# EAGLE design E4-blackpill-v2 (EAGLE 9.6.2)
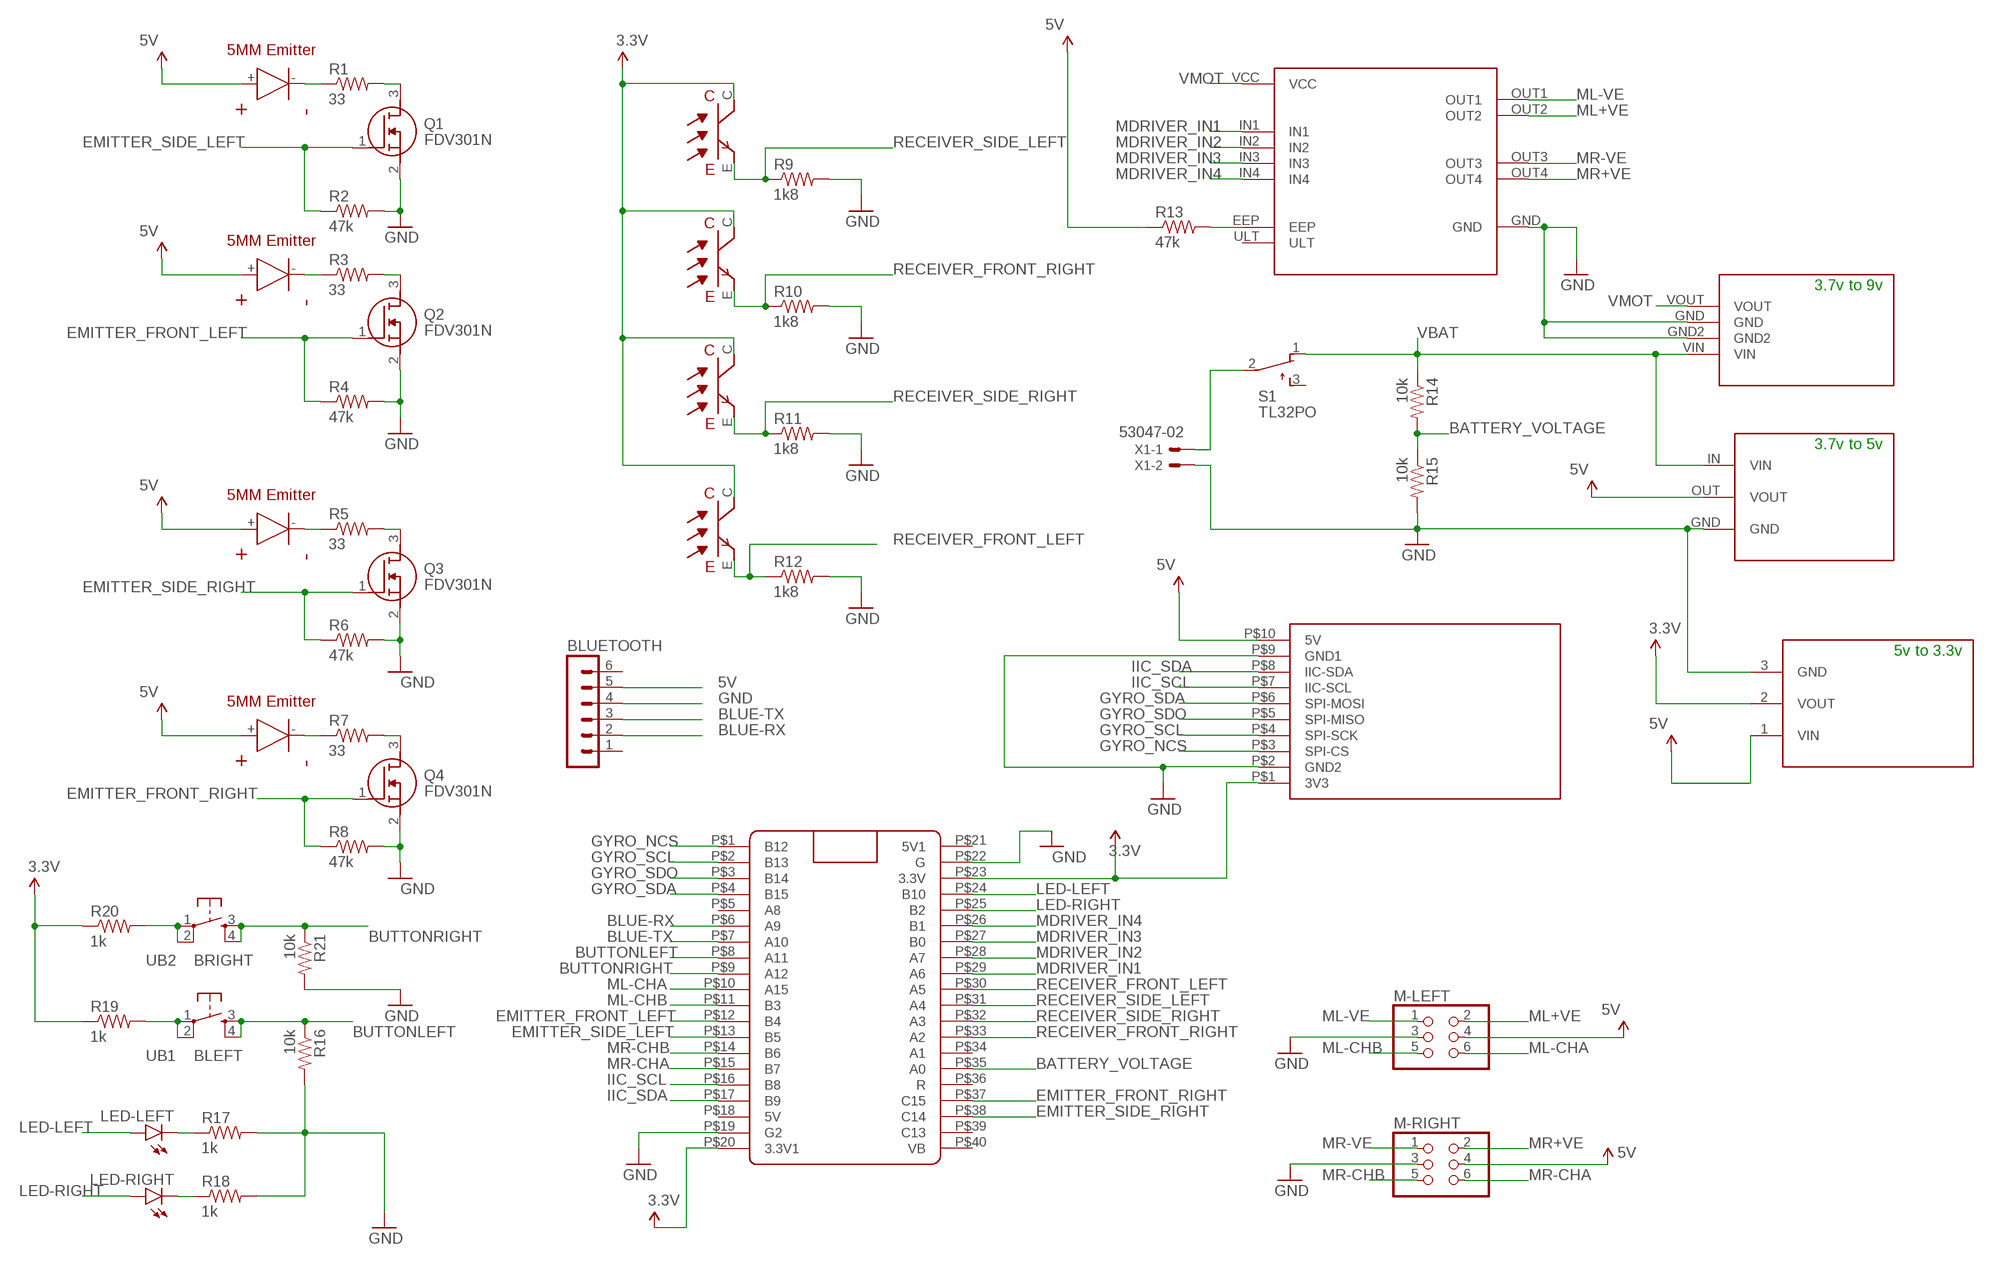
[diagram p0: schematic, sheet 1]

## Parts
BLUETOOTH  MA06-1  [MA06-1]
DET-FRONTLEFT  RECEIVER  [RECEIVER]
DET-FRONTRIGHT  RECEIVER  [RECEIVER]
DET-SIDELEFT  RECEIVER  [RECEIVER]
DET-SIDERIGHT  RECEIVER  [RECEIVER]
IR-FRONTLEFT  EMITTER  [EMITTER]
IR-FRONTRIGHT  EMITTER  [EMITTER]
IR-SIDELEFT  EMITTER  [EMITTER]
IR-SIDERIGHT  EMITTER  [EMITTER]
LED-LEFT  LEDSML0603  [SML0603]
LED-RIGHT  LEDSML0603  [SML0603]
M-LEFT  PINHD-2X3  [2X03]
M-RIGHT  PINHD-2X3  [2X03]
Q1  FDV301N  [SOT96P237X111-3N]
Q2  FDV301N  [SOT96P237X111-3N]
Q3  FDV301N  [SOT96P237X111-3N]
Q4  FDV301N  [SOT96P237X111-3N]
R1  33  RESISTOR1206  [1206]
R2  47k  RESISTOR0603-RES  [0603-RES]
R3  33  RESISTOR1206  [1206]
R4  47k  RESISTOR0603-RES  [0603-RES]
R5  33  RESISTOR1206  [1206]
R6  47k  RESISTOR0603-RES  [0603-RES]
R7  33  RESISTOR1206  [1206]
R8  47k  RESISTOR0603-RES  [0603-RES]
R9  1k8  RESISTOR0603-RES  [0603-RES]
R10  1k8  RESISTOR0603-RES  [0603-RES]
R11  1k8  RESISTOR0603-RES  [0603-RES]
R12  1k8  RESISTOR0603-RES  [0603-RES]
R13  47k  RESISTOR0603-RES  [0603-RES]
R14  10k  RESISTOR0603-RES  [0603-RES]
R15  10k  RESISTOR0603-RES  [0603-RES]
R16  10k  RESISTOR0603-RES  [0603-RES]
R17  1k  RESISTOR0603-RES  [0603-RES]
R18  1k  RESISTOR0603-RES  [0603-RES]
R19  1k  RESISTOR0603-RES  [0603-RES]
R20  1k  RESISTOR0603-RES  [0603-RES]
R21  10k  RESISTOR0603-RES  [0603-RES]
S1  TL32PO  [TL3XPO]
U$1  E4_SPI-IIC  [E4_SPI-IIC]
U$3  DRV8833  [DRV8833]
U$4  BUCK3TO9BUCK3TO9-HORIZONTAL  [BUCK3TO9-HORIZONTAL]
U$5  BUCK3TO5  [BUCK3TO5-H]
U$7  BLACK_PILL  [BLACK_PILL]
U$8  3V3-CONV3V3CONV  [6410-03]
UB1  BLEFT  TAC_SWITCHPTH  [TACTILE-PTH]
UB2  BRIGHT  TAC_SWITCHPTH  [TACTILE-PTH]
X1  53047-02  [53047-02]

## Nets
3.3V: DET-FRONTLEFT.C DET-FRONTRIGHT.C DET-SIDELEFT.C DET-SIDERIGHT.C R19.1 R20.1 U$1.P$1(3V3) U$7.P$20(3.3V1) U$7.P$23(3.3V) U$8.2(VOUT)
5V: BLUETOOTH.5 IR-FRONTLEFT.+ IR-FRONTRIGHT.+ IR-SIDELEFT.+ IR-SIDERIGHT.+ M-LEFT.4 M-RIGHT.4 R13.1 U$1.P$10(5V) U$5.OUT(VOUT) U$8.1(VIN)
BATTERY_VOLTAGE: R14.2 R15.1 U$7.P$35(A0)
BLUE-RX: BLUETOOTH.2 U$7.P$6(A9)
BLUE-TX: BLUETOOTH.3 U$7.P$7(A10)
BUTTONLEFT: R16.1 U$7.P$8(A11) UB1.3 UB1.4
BUTTONRIGHT: R21.1 U$7.P$9(A12) UB2.3 UB2.4
EMITTER_FRONT_LEFT: Q2.1(G) R4.1 U$7.P$12(B4)
EMITTER_FRONT_RIGHT: Q4.1(G) R8.1 U$7.P$37(C15)
EMITTER_SIDE_LEFT: Q1.1(G) R2.1 U$7.P$13(B5)
EMITTER_SIDE_RIGHT: Q3.1(G) R6.1 U$7.P$38(C14)
GND: BLUETOOTH.4 M-LEFT.3 M-RIGHT.3 Q1.2(S) Q2.2(S) Q3.2(S) Q4.2(S) R2.2 R4.2 R6.2 R8.2 R9.2 R10.2 R11.2 R12.2 R15.2 R16.2 R17.2 R18.2 R21.2 U$1.P$2(GND2) U$1.P$9(GND1) U$3.GND U$4.GND U$4.GND2 U$5.GND U$7.P$19(G2) U$7.P$22(G) U$8.3(GND) X1.2
GYRO_NCS: U$1.P$3(SPI-CS) U$7.P$1(B12)
GYRO_SCL: U$1.P$4(SPI-SCK) U$7.P$2(B13)
GYRO_SDA: U$1.P$6(SPI-MOSI) U$7.P$4(B15)
GYRO_SDO: U$1.P$5(SPI-MISO) U$7.P$3(B14)
IIC_SCL: U$1.P$7(IIC-SCL) U$7.P$16(B8)
IIC_SDA: U$1.P$8(IIC-SDA) U$7.P$17(B9)
LED-LEFT: LED-LEFT.A U$7.P$24(B10)
LED-RIGHT: LED-RIGHT.A U$7.P$25(B2)
MDRIVER_IN1: U$3.IN1 U$7.P$29(A6)
MDRIVER_IN2: U$3.IN2 U$7.P$28(A7)
MDRIVER_IN3: U$3.IN3 U$7.P$27(B0)
MDRIVER_IN4: U$3.IN4 U$7.P$26(B1)
ML+VE: M-LEFT.2 U$3.OUT2
ML-CHA: M-LEFT.6 U$7.P$10(A15)
ML-CHB: M-LEFT.5 U$7.P$11(B3)
ML-VE: M-LEFT.1 U$3.OUT1
MR+VE: M-RIGHT.2 U$3.OUT4
MR-CHA: M-RIGHT.6 U$7.P$15(B7)
MR-CHB: M-RIGHT.5 U$7.P$14(B6)
MR-VE: M-RIGHT.1 U$3.OUT3
N$1: IR-FRONTRIGHT.- R7.1
N$2: Q1.3(D) R1.2
N$3: IR-SIDELEFT.- R1.1
N$4: IR-FRONTLEFT.- R3.1
N$5: Q2.3(D) R3.2
N$6: Q4.3(D) R7.2
N$7: IR-SIDERIGHT.- R5.1
N$8: Q3.3(D) R5.2
N$9: R13.2 U$3.EEP
N$10: LED-RIGHT.C R18.1
N$11: LED-LEFT.C R17.1
N$12: R19.2 UB1.1 UB1.2
N$13: R20.2 UB2.1 UB2.2
N$14: S1.2(P) X1.1
RECEIVER_FRONT_LEFT: DET-FRONTLEFT.E R12.1 U$7.P$30(A5)
RECEIVER_FRONT_RIGHT: DET-FRONTRIGHT.E R10.1 U$7.P$33(A2)
RECEIVER_SIDE_LEFT: DET-SIDELEFT.E R9.1 U$7.P$31(A4)
RECEIVER_SIDE_RIGHT: DET-SIDERIGHT.E R11.1 U$7.P$32(A3)
VBAT: R14.1 S1.1(O) U$4.VIN U$5.IN(VIN)
VMOT: U$3.VCC U$4.VOUT
Unconnected: BLUETOOTH.1 BLUETOOTH.6 S1.3(S) U$3.ULT U$7.P$5(A8) U$7.P$18(5V) U$7.P$34(A1) U$7.P$36(R) U$7.P$39(C13) U$7.P$40(VB)

## Notes on the sheet
- 3.7v to 9v
- 3.7v to 5v
- 5v to 3.3v

## Power pins joined to a net without a drawn wire
5V1: U$7.P$21(5V1)

## Library data of the parts
BLUETOOTH = con-lstb:MA06-1: PIN HEADER; OC_FARNELL: unknown; OC_NEWARK: unknown
DET-FRONTLEFT DET-FRONTRIGHT DET-SIDELEFT DET-SIDERIGHT = sfh4550 & teft4300:RECEIVER
IR-FRONTLEFT IR-FRONTRIGHT IR-SIDELEFT IR-SIDERIGHT = sfh4550 & teft4300:EMITTER
LED-LEFT LED-RIGHT = led:LED: LED OSRAM: - CHIPLED LG R971, LG N971, LY N971, LG Q971, LY Q971, LO R971, LY R971 LH N974, LH R974 LS Q976, LO Q976, LY Q976 LO Q996 - Hyper CHIPLED LW Q18S LB Q993, LB Q99A, LB R99A - SideLED LS A670, LO A670, LY A670, LG A670, LP A670 LB A673, LV A673, LT A673, LW A673 LH A674 LY A675 LS A676, LA A676, LO A676, LY A676, LW A676 LS A679, LY A679, LG A679 - Hyper Micro SIDELED® LS Y876, LA Y876, LO Y876, LY Y876 LT Y87S - SmartLED LW L88C, LW L88S LB L89C, LB L89S, LG L890 LS L89K, LO L89K, LY L89K LS L896, LA L896, LO L896, LY L896 - TOPLED LS T670, LO T670, LY T670, LG T670, LP T670 LSG T670, LSP T670, LSY T670, LOP T670, LYG T670 LG T671, LOG T671, LSG T671 LB T673, LV T673, LT T673, LW T673 LH T674 LS T676, LA T676, LO T676, LY T676, LB T676, LH T676, LSB T676, LW T676 LB T67C, LV T67C, LT T67C, LS T67K, LO T67K, LY T67K, LW E67C LS E67B, LA E67B, LO E67B, LY E67B, LB E67C, LV E67C, LT E67C LW T67C LS T679, LY T679, LG T679 LS T770, LO T770, LY T770, LG T770, LP T770 LB T773, LV T773, LT T773, LW T773 LH T774 LS E675, LA E675, LY E675, LS T675 LS T776, LA T776, LO T776, LY T776, LB T776 LHGB T686 LT T68C, LB T68C - Hyper Mini TOPLED® LB M676 - Mini TOPLED Santana® LG M470 LS M47K, LO M47K, LY M47K Source: http://www.osram.convergy.de LUXEON: - LUMILED® LXK2-PW12-R00, LXK2-PW12-S00, LXK2-PW14-U00, LXK2-PW14-V00 LXK2-PM12-R00, LXK2-PM12-S00, LXK2-PM14-U00 LXK2-PE12-Q00, LXK2-PE12-R00, LXK2-PE12-S00, LXK2-PE14-T00, LXK2-PE14-U00 LXK2-PB12-K00, LXK2-PB12-L00, LXK2-PB12-M00, LXK2-PB14-N00, LXK2-PB14-P00, LXK2-PB14-Q00 LXK2-PR12-L00, LXK2-PR12-M00, LXK2-PR14-Q00, LXK2-PR14-R00 LXK2-PD12-Q00, LXK2-PD12-R00, LXK2-PD12-S00 LXK2-PH12-R00, LXK2-PH12-S00 LXK2-PL12-P00, LXK2-PL12-Q00, LXK2-PL12-R00 Source: www.luxeon.com KINGBRIGHT: KA-3528ASYC Source: www.kingbright.com
M-LEFT M-RIGHT = SparkFun:PINHD-2X3: PIN HEADER
Q1-Q4 = FDV301N:FDV301N: MOSFET N-Channel 25V 0.5A SOT23 Fairchild FDV301N N-channel MOSFET Transistor, 0.22 A, 25 V, 3-Pin SOT-23 Source: Datasheet <https://datasheet.datasheetarchive.com/originals/distributors/Datasheets_SAMA/0cce9550595c1a9ba17b856c55fee955.pdf>; ARROW_PART_NUMBER: FDV301N; ARROW_PRICE-STOCK: https://www.arrow.com/en/products/fdv301n/on-semiconductor?region=nac; DESCRIPTION: MOSFET N-Channel 25V 0.5A SOT23 Fairchild FDV301N N-channel MOSFET Transistor, 0.22 A, 25 V, 3-Pin SOT-23; HEIGHT: 1.11mm; MANUFACTURER_NAME: onsemi; MANUFACTURER_PART_NUMBER: FDV301N; MOUSER_PART_NUMBER: 512-FDV301N; MOUSER_PRICE-STOCK: https://www.mouser.co.uk/ProductDetail/ON-Semiconductor-Fairchild/FDV301N?qs=HK%252BeIG1iaahv7gPT5tsFJQ%3D%3D
R1-R21 = SparkFun:RESISTOR: Resistor Basic schematic elements and footprints for 0603, 1206, and PTH resistors.
S1 = switch:TL32PO: TINY SWITCH ON - MOM Source: http://www2.produktinfo.conrad.com/datenblaetter/700000-724999/705152-da-01-de-Subminiaturschalter_TL_36YO.pdf
U$1 = E4:E4_SPI-IIC
U$3 = E4:DRV8833
U$4 = E4:BUCK3TO9
U$5 = E4:BUCK3TO5
U$7 = E4:BLACK_PILL
U$8 = E4:3V3-CONV
UB1 UB2 = SparkFun:TAC_SWITCH: Momentary Switch Button commonly used for reset or general input. Spark Fun Electronics SKU : COM-00097
X1 = con-molex:53?-02: CONNECTOR wire to board 1.25 mm (.049 inch) pitch header; MF: MOLEX; MPN: 53047-0210; OC_FARNELL: 9733051; OC_NEWARK: 57H4701

## Board
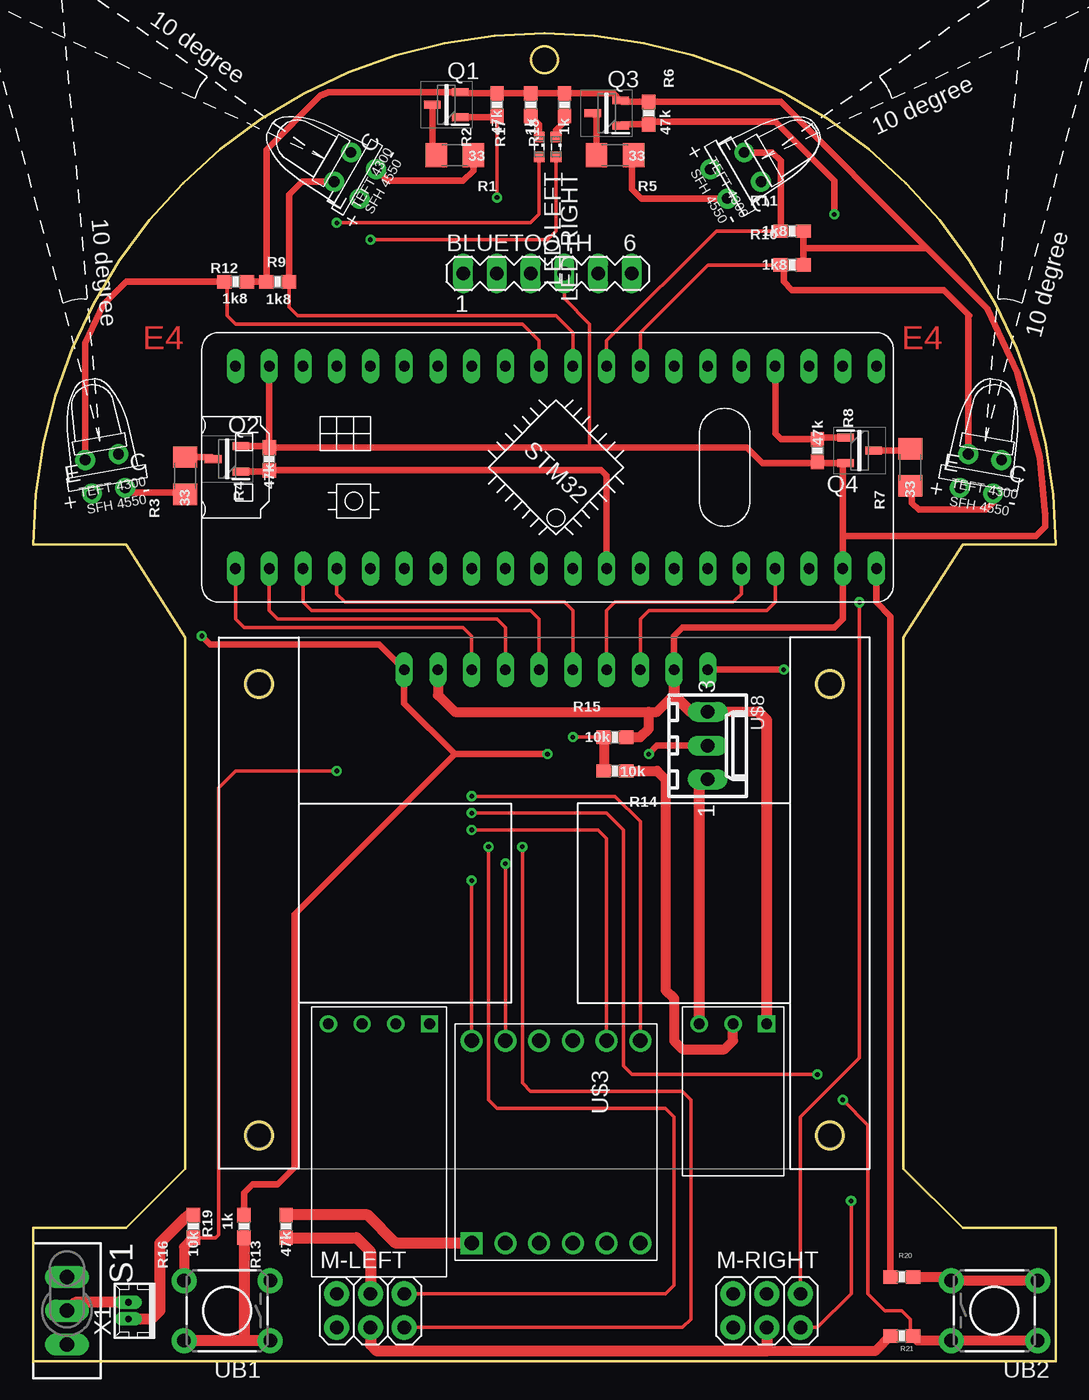
[diagram p1: board, top side]
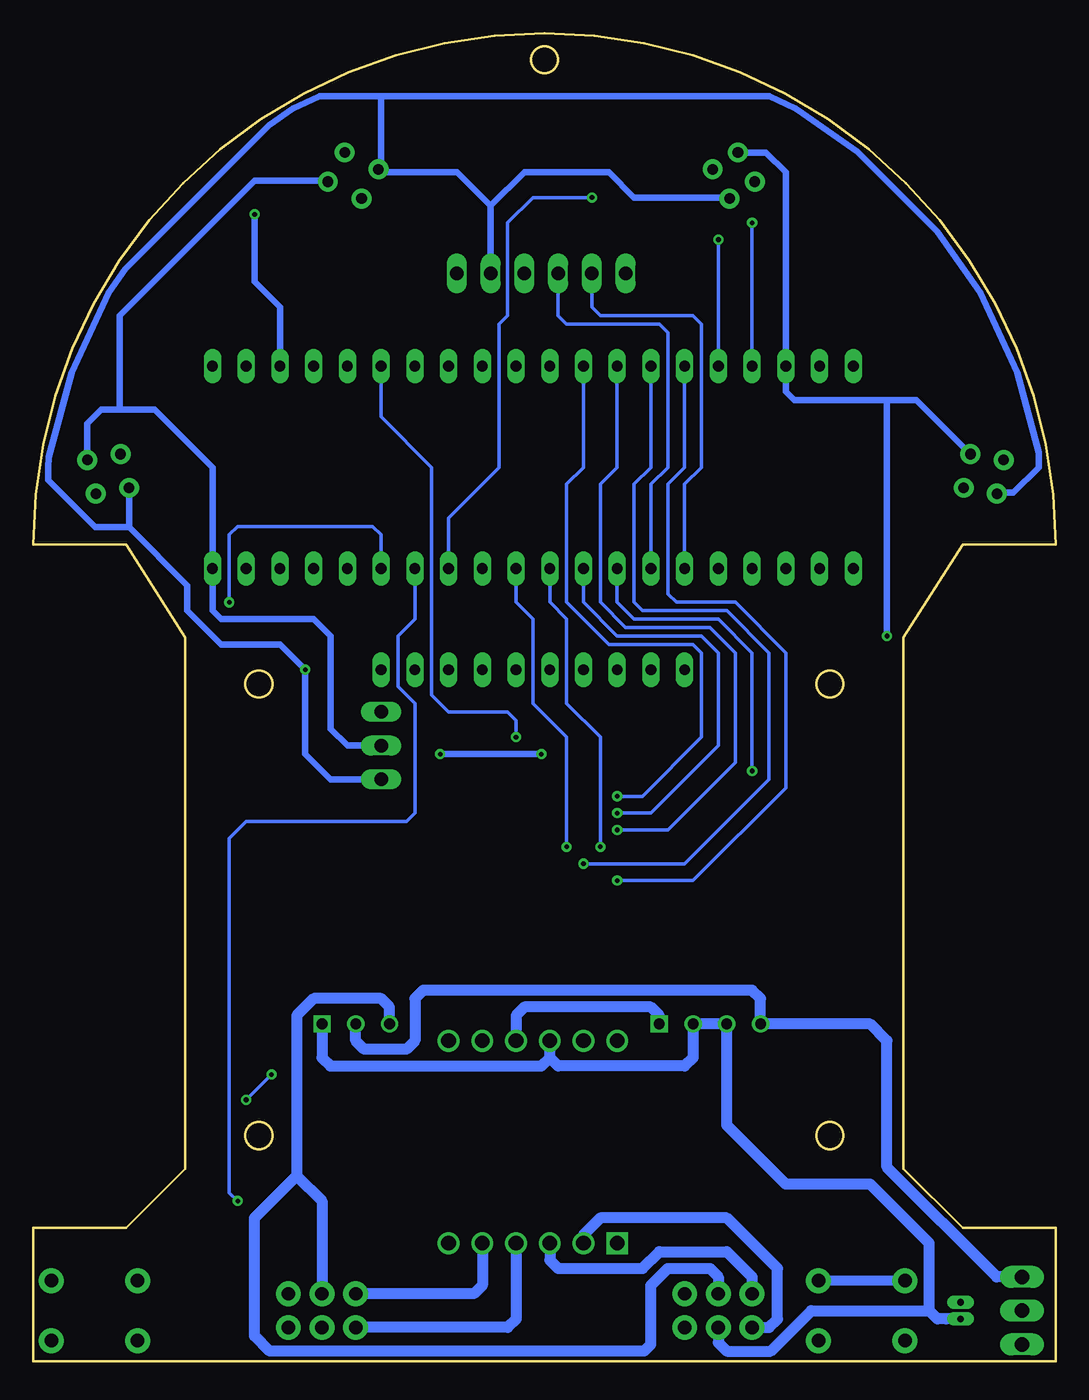
[diagram p2: board, bottom side, seen from below]

Size 77 x 100 mm. Coordinates in mm from the lower left corner, seen from the top.
Outline: 0,0 77,0 77,10.04 70,10.04 65.54,14.5 65.54,54.5 70,61.5 77,61.5 arc180 0,61.5 7,61.5 11.46,54.5 11.46,14.5 7,10.04 0,10.04 0,0
Outline: circle at 17,17 radius 1
Outline: circle at 60,17 radius 1
Outline: circle at 60,51 radius 1
Outline: circle at 17,51 radius 1
Outline: circle at 38.5,98 radius 1
Copper layers (1*16): Top 0.035mm / dielectric 1.5mm / Bottom 0.035mm
Design rules "default *": minimum track width 10mil, minimum drill 0.35mm, track to track 10mil, track to pad 10mil, pad to pad 10mil, via to via 10mil, smd to smd 10mil, copper to edge 10mil, drill to drill 6mil, minimum pad ring 10mil, minimum via ring 8mil, stop-mask expansion 4mil, vias tented up to drill 0mil, thermal gap 10mil

### Footprints (pad centres in the part's own frame; a part is rotated, then mirrored left to right if it is on the bottom)
MA06-1 = drill 1.016 long: 1 -6.35,0; 2 -3.81,0; 3 -1.27,0; 4 1.27,0; 5 3.81,0; 6 6.35,0
RECEIVER = drill 0.8 pad 1.5: C 1.27,-0.5; E -1.27,-0.5
EMITTER = drill 0.8 pad 1.5: + -1.27,-0.5; - 1.27,-0.5
SML0603 = smd 0.8 x 0.8: A 0.75,0; C -0.75,0
2X03 = drill 1.016 pad 1.88: 1 -2.54,-1.27; 2 -2.54,1.27; 3 0,-1.27; 4 0,1.27; 5 2.54,-1.27; 6 2.54,1.27
SOT96P237X111-3N = smd 1.25 x 0.6: 1 -1.05,0.955; 2 -1.05,-0.955; 3 1.05,0
1206 = smd 1.6 x 1.8: 1 -1.4,0; 2 1.4,0
0603-RES = smd 1.1 x 1: 1 -0.85,0; 2 0.85,0
TL3XPO = drill 1.1 pad 1.422 long: 1 -2.54,0; 2 0,0; 3 2.54,0
E4_SPI-IIC = drill 0.8 long: P$1 -10.16,34.29; P$2 -7.62,34.29; P$3 -5.08,34.29; P$4 -2.54,34.29; P$5 0,34.29; P$6 2.54,34.29; P$7 5.08,34.29; P$8 7.62,34.29; P$9 10.16,34.29; P$10 12.7,34.29 | hole 2: -21.1,33.22; -21.1,-0.78; 21.9,33.22; 21.9,-0.78
DRV8833 = drill 1.1 square: EEP -7.62,5.08 | drill 1.1: GND 7.62,0; IN1 7.62,-7.62; IN2 7.62,-5.08; IN3 7.62,2.54; IN4 7.62,5.08; OUT1 -7.62,2.54; OUT2 -7.62,0; OUT3 -7.62,-2.54; OUT4 -7.62,-5.08; ULT -7.62,-7.62; VCC 7.62,-2.54
BUCK3TO9-HORIZONTAL = drill 0.8: GND -8.89,-5.08; GND2 -6.35,-5.08; VIN -3.81,-5.08 | drill 0.8 square: VOUT -11.43,-5.08
BUCK3TO5-H = drill 0.8 square: GND -8.89,0 | drill 0.8: IN -6.35,0; OUT -3.81,0
BLACK_PILL = drill 0.8 long: P$1 -7.62,15.24; P$2 -7.62,12.7; P$3 -7.62,10.16; P$4 -7.62,7.62; P$5 -7.62,5.08; P$6 -7.62,2.54; P$7 -7.62,0; P$8 -7.62,-2.54; P$9 -7.62,-5.08; P$10 -7.62,-7.62; P$11 -7.62,-10.16; P$12 -7.62,-12.7; P$13 -7.62,-15.24; P$14 -7.62,-17.78; P$15 -7.62,-20.32; P$16 -7.62,-22.86; P$17 -7.62,-25.4; P$18 -7.62,-27.94; P$19 -7.62,-30.48; P$20 -7.62,-33.02; P$21 7.62,15.24; P$22 7.62,12.7; P$23 7.62,10.16; P$24 7.62,7.62; P$25 7.62,5.08; P$26 7.62,2.54; P$27 7.62,0; P$28 7.62,-2.54; P$29 7.62,-5.08; P$30 7.62,-7.62; P$31 7.62,-10.16; P$32 7.62,-12.7; P$33 7.62,-15.24; P$34 7.62,-17.78; P$35 7.62,-20.32; P$36 7.62,-22.86; P$37 7.62,-25.4; P$38 7.62,-27.94; P$39 7.62,-30.48; P$40 7.62,-33.02
6410-03 = drill 1.016 long: 1 2.54,0; 2 0,0; 3 -2.54,0
TACTILE-PTH = drill 1.016 pad 1.88: 1 -3.251,2.261; 2 3.251,2.261; 3 -3.251,-2.261; 4 3.251,-2.261
53047-02 = drill 0.5 pad 0.698 long: 1 0.625,0.45; 2 -0.625,0.45

### Placement (x,y rotation side)
BLUETOOTH  38.73,81.92 0 top
DET-FRONTLEFT  5.08,68.58 10 top
DET-FRONTRIGHT  71.75,68.58 350 top
DET-SIDELEFT  22.86,90.17 60 top
DET-SIDERIGHT  54.61,90.17 300 top
IR-FRONTLEFT  5.59,66.04 10 top
IR-FRONTRIGHT  71.12,66.04 350 top
IR-SIDELEFT  24.77,88.9 60 top
IR-SIDERIGHT  52.07,88.9 300 top
LED-LEFT  38.1,91.44 270 top
LED-RIGHT  39.37,91.44 270 top
M-LEFT  25.4,3.81 0 top
M-RIGHT  55.24,3.81 0 top
Q1  31.11,94.61 180 top
Q2  14.61,67.94 180 top
Q3  43.18,93.98 180 top
Q4  62.23,68.58 0 top
R1  31.75,90.81 180 top
R2  34.92,94.61 90 top
R3  11.43,66.67 90 top
R4  17.78,67.94 90 top
R5  43.81,90.81 180 top
R6  46.35,93.98 90 top
R7  66.04,67.31 90 top
R8  59.05,68.58 270 top
R9  18.41,81.28 180 top
R10  57.15,82.55 0 top
R11  57.15,85.09 0 top
R12  15.24,81.28 0 top
R13  19.05,10.16 90 top
R14  43.81,44.45 180 top
R15  43.81,46.99 0 top
R16  12.06,10.16 90 top
R17  37.47,94.61 90 top
R18  40.01,94.61 90 top
R19  15.88,10.16 270 top
R20  65.41,6.35 0 top
R21  65.41,1.91 180 top
S1  2.54,3.81 270 top
U$1  38.1,17.78 0 top
U$3  38.1,16.51 90 top
U$4  18.41,20.32 180 top
U$5  46.35,25.4 180 top
U$7  30.48,67.31 90 top
U$8  50.8,46.35 270 top
UB1  14.61,3.81 180 top
UB2  72.39,3.81 0 top
X1  7.62,3.81 90 top

### Tracks (layer width: path | path; a pad name or v marks a point on that pad's centre or on a via)
3.3V  (via drill 0.35)
  Top 0.508: R19.1 15.88,12.7 16.51,13.34 18.41,13.34 19.68,14.61 19.68,33.66 31.75,45.72 | R20.1 64.56,56.09 63.5,57.15 U$7.P$20 | U$8.2 46.99,46.35 v46.35,45.72 | v38.73,45.72 31.75,45.72 | 31.75,45.72 27.94,49.53 U$1.P$1 26.04,53.98 13.34,53.98 v12.7,54.61
  Bottom 0.508: U$8.2 53.34,46.35 54.61,47.62 54.61,54.61 55.88,55.88 62.87,55.88 63.5,56.52 U$7.P$20 63.5,67.31 67.84,71.65 70.48,71.65 | DET-SIDERIGHT.C 54.89,88.9 60.33,88.9 70.48,78.74 70.48,71.65 | DET-FRONTLEFT.C 10.5,72.39 12.7,72.39 | 12.7,72.39 19.68,72.39 20.32,73.03 U$7.P$23 20.32,89.53 21.8,91.02 DET-SIDELEFT.C | 12.7,72.39 v12.7,54.61 | v46.35,45.72 v38.73,45.72 | DET-FRONTRIGHT.C 72.92,70.59 71.86,71.65 70.48,71.65
5V  (via drill 0.35)
  Top 0.508: U$1.P$10 v56.52,52.07
  Top 0.813: U$5.OUT 50.16,43.18 U$8.1 | R13.1 24.34,9.31 25.4,8.26 M-LEFT.4
  Bottom 0.508: IR-FRONTLEFT.+ 4.35,65.41 3.17,65.41 1.27,67.31 1.27,68.4 2.89,74.46 5.68,80.45 8.92,85.07 14.93,91.08 19.06,93.97 | 19.06,93.97 | 19.06,93.97 19.55,94.31 21.56,95.25 50.8,95.25 | 50.8,95.25 55.44,95.25 57.45,94.31 59.25,93.05 70.05,82.25 71.31,80.45 74.11,74.46 75.82,68.08 75.89,67.28 75.89,66.36 72.32,62.8 69.78,62.8 | U$8.1 54.61,43.81 56.52,45.72 v56.52,52.07 58.42,53.98 62.87,53.98 65.41,56.52 65.41,58.42 69.78,62.8 | 42.55,87 45.09,89.53 50.79,89.53 IR-SIDERIGHT.+ 50.8,89.95 50.8,95.25 | 42.55,87 BLUETOOTH.5 | 69.78,62.8 IR-FRONTRIGHT.+ | IR-SIDELEFT.+ 24.64,87.63 31.75,87.63 33.66,89.53 40.01,89.53 42.55,87
  Bottom 0.813: U$5.OUT 50.16,26.67 50.8,27.3 55.88,27.3 57.15,26.04 57.15,13.97 | M-RIGHT.4 55.24,12.06 57.15,13.97 | 57.15,13.97 60.33,10.79 60.33,1.91 59.18,0.76 30.99,0.76 30.48,1.27 30.48,5.71 29.21,6.99 26.04,6.99 25.4,6.35 M-LEFT.4
BATTERY_VOLTAGE  (via drill 0.35)
  Top 0.254: v40.64,46.99 R15.1
  Top 0.762: R15.1 R14.2
  Bottom 0.254: U$7.P$35 50.8,71.12 46.99,67.31 46.99,50.16 45.72,48.9 41.27,48.9 40.64,48.26 v40.64,46.99
BLUE-RX
  Bottom 0.254: U$7.P$6 27.94,66.04 26.67,67.31 26.67,78.11 27.3,78.74 34.29,78.74 34.92,79.38 BLUETOOTH.2
BLUE-TX
  Bottom 0.254: U$7.P$7 30.48,66.04 29.21,67.31 29.21,77.47 29.84,78.11 36.83,78.11 37.47,78.74 BLUETOOTH.3
BUTTONLEFT  (via drill 0.35)
  Top 0.254: R16.1 13.76,9.31 13.97,9.53 13.97,43.18 15.24,44.45 v22.86,44.45
  Top 0.762: R16.1 11.35,8.6 UB1.4
  Bottom 0.254: U$7.P$8 33.02,57.15 31.75,55.88 25.4,55.88 22.86,53.34 v22.86,44.45
  Bottom 0.762: UB1.4 UB1.3
BUTTONRIGHT  (via drill 0.35)
  Top 0.254: R21.1 66.04,2.12 66.04,3.17 65.41,3.81 64.14,3.81 62.87,5.08 62.87,17.78 v60.96,19.68 | v33.02,41.27 43.18,41.27 44.45,40.01 44.45,22.23 45.09,21.59 v59.05,21.59
  Top 0.762: UB2.4 UB2.3 66.61,1.55 R21.1
  Bottom 0.254: U$7.P$9 35.56,57.15 33.02,54.61 26.67,54.61 25.4,53.34 25.4,46.35 30.48,41.27 v33.02,41.27 | v60.96,19.68 v59.05,21.59
EMITTER_FRONT_LEFT
  Top 0.508: Q2.1 17.68,66.99 R4.1 42.76,67.09 43.18,66.67 U$7.P$12
EMITTER_FRONT_RIGHT
  Top 0.508: Q4.1 59.16,69.53 R8.1 56.3,69.43 55.88,69.85 U$7.P$37
EMITTER_SIDE_LEFT  (via drill 0.35)
  Top 0.254: R2.1 v34.92,87.63
  Top 0.508: Q1.1 34.82,93.66 R2.1
  Bottom 0.254: v34.92,87.63 39.37,87.63 41.27,85.72 41.27,78.74 41.91,78.11 41.91,67.31 45.72,63.5 U$7.P$13
EMITTER_SIDE_RIGHT  (via drill 0.35)
  Top 0.508: Q3.1 44.34,93.13 R6.1 46.57,93.34 55.88,93.34 60.33,88.9 v60.33,86.36
  Bottom 0.508: v60.33,86.36 60.33,81.28 58.42,79.38 U$7.P$38
GND
  Top 0.254: 41.91,68.8 41.91,78.11 40.01,80.01 BLUETOOTH.4
  Top 0.508: 59.16,67.62 R8.2 | Q2.2 17.68,68.9 R4.2 | 67.31,83.82 56.3,94.83 R6.2 44.34,94.83 Q3.2 43.7,95.47 R18.2 R17.2 R2.2 32.27,95.47 Q1.2 22.24,95.57 21.62,95.28 17.57,91.22 R9.2 R12.2 | 67.31,83.82 71.87,79.26 74.11,74.46 75.82,68.08 76.2,63.7 76.2,62.87 75.48,62.15 61.04,62.15 60.96,62.23 | 59.16,67.62 Q4.2 60.96,67.41 60.96,62.23 | 60.96,61.43 U$7.P$19 | 60.96,62.23 U$7.P$19 | R11.2 58,83.82 | 58,83.82 R10.2 | 58,83.82 67.31,83.82 | U$1.P$9 48.26,54.61 48.9,55.24 60.33,55.24 60.96,55.88 U$7.P$19 | U$7.P$22 R4.2 | R4.2 41.91,68.8 53.76,68.8 54.93,67.62 59.16,67.62
  Top 0.762: R21.2 63.41,0.76 55.24,0.76 | U$1.P$2 30.48,50.16 31.75,48.9 46.35,48.9 | 46.35,48.9 46.99,48.9 48.26,50.16 | R15.2 45.72,46.99 46.35,47.62 46.35,48.9 | 54.61,48.9 U$8.3 | R16.2 11.64,11.01 11.43,10.79
  Top 0.813: M-LEFT.3 25.4,1.27 25.91,0.76 55.24,0.76 M-RIGHT.3 | U$5.GND 55.24,48.26 54.61,48.9 | U$8.3 49.53,48.9 48.26,50.16 U$1.P$9 | 11.43,10.79 9.53,8.89 9.53,3.81 8.89,3.17 7.18,3.17 X1.2
  Bottom 0.813: 8.26,3.17 8.24,3.19 X1.2 8.9,3.19 9.53,3.81 | 9.53,3.81 9.53,8.89 13.97,13.34 20.32,13.34 24.77,17.78 U$4.GND2 U$4.GND 27.3,22.86 27.94,22.23 37.47,22.23 38.1,22.86 | U$5.GND 55.24,22.86 54.61,22.23 38.73,22.23 38.1,22.86 | 38.1,22.86 U$3.GND | M-LEFT.3 25.4,1.4 24.77,0.76 21.46,0.76 18.41,3.81 9.53,3.81
GYRO_NCS
  Top 0.254: U$7.P$1 15.24,55.88 15.88,55.24 32.38,55.24 33.02,54.61 U$1.P$3
GYRO_SCL
  Top 0.254: U$7.P$2 17.78,56.52 18.41,55.88 34.92,55.88 35.56,55.24 U$1.P$4
GYRO_SDA
  Top 0.254: U$7.P$4 22.86,57.78 23.5,57.15 40.01,57.15 40.64,56.52 U$1.P$6
GYRO_SDO
  Top 0.254: U$1.P$5 38.1,55.88 37.47,56.52 20.95,56.52 20.32,57.15 U$7.P$3
IIC_SCL
  Top 0.254: U$7.P$16 53.34,57.78 52.7,57.15 43.81,57.15 43.18,56.52 U$1.P$7
IIC_SDA
  Top 0.254: U$7.P$17 55.88,57.15 55.24,56.52 46.35,56.52 45.72,55.88 U$1.P$8
LED-LEFT  (via drill 0.35)
  Top 0.254: LED-LEFT.A 38.1,86.36 37.47,85.72 v22.86,85.72
  Bottom 0.254: v22.86,85.72 U$7.P$24
LED-RIGHT  (via drill 0.35)
  Top 0.254: LED-RIGHT.A 39.37,85.09 38.73,84.45 v25.4,84.45
  Bottom 0.254: v25.4,84.45 U$7.P$25
MDRIVER_IN1  (via drill 0.35)
  Top 0.254: v33.02,42.55 43.81,42.55 45.72,40.64 U$3.IN1
  Bottom 0.254: U$7.P$29 35.56,67.31 36.83,66.04 36.83,57.15 33.66,53.98 27.3,53.98 26.67,53.34 26.67,46.99 31.11,42.55 v33.02,42.55
MDRIVER_IN2  (via drill 0.35)
  Top 0.254: v33.02,40.01 42.55,40.01 43.18,39.37 U$3.IN2
  Bottom 0.254: U$7.P$28 33.02,67.31 34.29,66.04 34.29,57.15 32.38,55.24 26.04,55.24 24.13,53.34 24.13,45.09 29.21,40.01 v33.02,40.01
MDRIVER_IN3  (via drill 0.35)
  Top 0.254: v35.56,37.47 U$3.IN3
  Bottom 0.254: U$7.P$27 30.48,67.31 31.75,66.04 31.75,57.15 31.11,56.52 24.77,56.52 21.59,53.34 21.59,43.81 27.94,37.47 v35.56,37.47
MDRIVER_IN4  (via drill 0.35)
  Top 0.254: U$3.IN4 v33.02,36.2
  Bottom 0.254: U$7.P$26 27.94,67.31 29.21,66.04 29.21,57.78 28.57,57.15 24.13,57.15 20.32,53.34 20.32,43.18 27.3,36.2 v33.02,36.2
ML+VE
  Bottom 0.813: U$3.OUT2 38.1,7.62 37.47,6.99 31.11,6.99 29.84,8.26 24.77,8.26 22.86,6.35 M-LEFT.2
ML-CHA  (via drill 0.35)
  Top 0.254: M-LEFT.6 47.62,5.08 48.26,5.71 48.26,18.41 47.62,19.05 34.92,19.05 34.29,19.68 v34.29,38.73
  Bottom 0.254: U$7.P$10 38.1,57.15 36.83,55.88 36.83,49.53 34.29,46.99 v34.29,38.73
ML-CHB  (via drill 0.35)
  Top 0.254: v36.83,38.73 36.83,20.95 37.47,20.32 48.9,20.32 49.53,19.68 49.53,3.17 48.9,2.54 M-LEFT.5
  Bottom 0.254: U$7.P$11 40.64,57.15 39.37,55.88 39.37,49.53 36.83,46.99 v36.83,38.73
ML-VE
  Bottom 0.813: U$3.OUT1 35.56,9.53 34.29,10.79 24.77,10.79 20.95,6.99 20.95,3.17 21.59,2.54 M-LEFT.1
MR+VE
  Bottom 0.813: M-RIGHT.2 43.81,5.08 43.18,5.71 U$3.OUT4
MR-CHA  (via drill 0.35)
  Top 0.254: v62.23,57.15 62.23,22.86 57.78,18.41 M-RIGHT.6
  Bottom 0.254: v62.23,57.15 62.23,62.23 61.59,62.87 51.44,62.87 50.8,62.23 U$7.P$15
MR-CHB  (via drill 0.35)
  Top 0.254: v61.59,12.06 61.59,5.08 59.05,2.54 M-RIGHT.5
  Bottom 0.254: U$7.P$14 48.26,55.88 49.53,54.61 49.53,50.8 48.26,49.53 48.26,41.27 48.9,40.64 60.96,40.64 62.23,39.37 62.23,12.7 v61.59,12.06
MR-VE
  Bottom 0.813: M-RIGHT.1 41.27,2.54 40.64,3.17 U$3.OUT3
N$1
  Top 0.508: R7.1 66.18,65.77 66.18,64.63 66.67,64.14 71.75,64.14 72.28,64.66 IR-FRONTRIGHT.-
N$2
  Top 0.508: Q1.3 30.07,91.09 R1.2
N$3
  Top 0.508: IR-SIDELEFT.- 26.68,88.9 32.38,88.9 33.15,89.67 R1.1
N$4
  Top 0.508: IR-FRONTLEFT.- 7.29,65.41 11.3,65.41 R3.1
N$5
  Top 0.508: R3.2 13.43,68.08 Q2.3
N$6
  Top 0.508: Q4.3 65.91,68.58
  Top 0.762: 65.91,68.58 R7.2
N$7
  Top 0.508: IR-SIDERIGHT.- 45.8,87.55 45.09,88.27 45.09,90.67 R5.1
N$8
  Top 0.508: Q3.3 42.41,93.69 R5.2
N$9
  Top 0.813: R13.2 25.18,11.01 27.3,8.89 U$3.EEP
N$10
  Top 0.508: R18.1 40.01,93.34 39.37,92.71 LED-RIGHT.C
N$11
  Top 0.508: R17.1 38.1,93.13 LED-LEFT.C
N$12
  Top 0.813: UB1.1 15.88,1.55 | 15.88,1.55 UB1.2 | R19.2 15.88,1.55
N$13
  Top 0.762: UB2.2 UB2.1 68.86,6.35 R20.2
N$14
  Top 0.813: X1.1 3.17,4.43 S1.2
RECEIVER_FRONT_LEFT
  Top 0.254: 14.61,81.06 14.61,78.74 15.24,78.11 36.83,78.11 38.1,76.83 U$7.P$30
  Top 0.508: DET-FRONTLEFT.E 3.92,76.65 5.28,79.57 6.99,81.28 R12.1 14.61,81.06
RECEIVER_FRONT_RIGHT
  Top 0.254: U$7.P$33 45.72,77.47 50.8,82.55 R10.1
  Top 0.508: R10.1 56.52,82.33 56.52,81.28 57.15,80.64 68.58,80.64 70.48,78.74 70.42,78.67 DET-FRONTRIGHT.E
RECEIVER_SIDE_LEFT
  Top 0.254: U$7.P$31 40.64,77.47 39.37,78.74 19.9,78.74 19.27,79.38 R9.1
  Top 0.508: DET-SIDELEFT.E 20.24,88.82 19.27,87.84 R9.1
RECEIVER_SIDE_RIGHT
  Top 0.254: U$7.P$32 43.18,76.83 51.44,85.09 R11.1
  Top 0.508: DET-SIDERIGHT.E 55.66,91.02 56.3,90.39 R11.1
VBAT
  Top 0.762: R14.1 46.99,44.45 47.62,43.81 47.62,27.94 48.26,27.3 48.26,24.13 48.9,23.5 52.07,23.5 52.7,24.13 U$5.IN
  Bottom 0.813: S1.1 4.45,6.35 12.7,14.61 12.7,24.13 13.97,25.4 U$4.VIN 22.23,27.3 22.86,27.94 47.62,27.94 48.26,27.3 48.26,24.13 48.9,23.5 52.07,23.5 52.7,24.13 U$5.IN
VMOT
  Bottom 0.813: U$4.VOUT 29.84,26.04 30.48,26.67 40.01,26.67 40.64,26.04 U$3.VCC

### Text on the board
Top: E4 | E4